# Altium schematic sheet Gagabiro_supply_maida.SchDoc: Gagabiro Power Supply Main
size 292 x 193 mm; ApprovedBy: None; CheckedBy: None; Author: João Victor Colombari Carlet; CompanyName: SEL; DrawnBy: João Victor Colombari Carlet; Engineer: João Victor Colombari Carlet; Organization: SEL; Address1: EESC - USP; Address2: 400, Trabalhador São-Carlense Av.; Address3: 13566-590, São Carlos; Address4: São Paulo, Brazil; DocumentNumber: Doc Num; Revision: 0; SheetNumber: 2; SheetTotal: 4
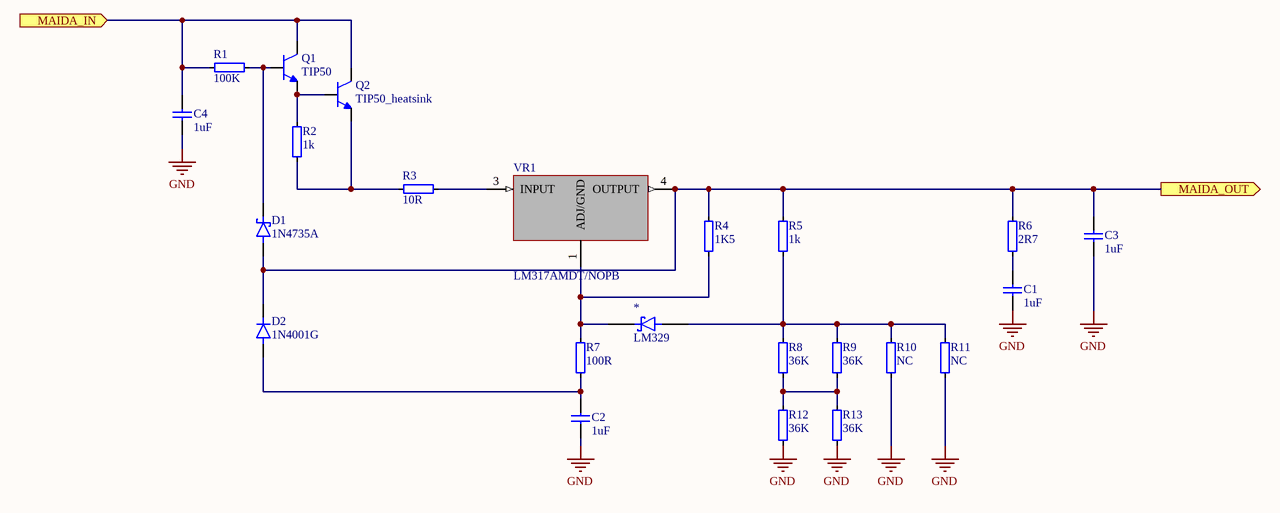
[diagram p0: Gagabiro_supply_maida.SchDoc]

## Parts
*  LM329  [TO92127P495H495-3]
C1  1uF  [CAP_panassonic_1u_450V]
C2  1uF  [CAP_panassonic_1u_450V]
C3  1uF  [CAP_panassonic_1u_450V]
C4  1uF  [CAP_panassonic_1u_450V]
D1  1N4735A  [DIOAD1036W78L463D272]
D2  1N4001G  [DIOAD1036W78L470D235]
Q1  TIP50  [TO254P1009X445X1985-3]
Q2  TIP50_heatsink  [TO254P1009X445X1985-3_heatsink]
R1  100K  [RES_2W_vertical]
R2  1k  [RES_2W_vertical]
R3  10R  [RES_2W_vertical]
R4  1K5  [RES_2W_vertical]
R5  1k  [RES_2W_vertical]
R6  2R7  [RES_2W_vertical]
R7  100R  [RES_2W_vertical]
R8  36K  [RES_2W_vertical]
R9  36K  [RES_2W_vertical]
R10  NC  [RES_2W_vertical]
R11  NC  [RES_2W_vertical]
R12  36K  [RES_2W_vertical]
R13  36K  [RES_2W_vertical]
VR1  LM317AMDT/NOPB  [TO228P991X255-3N]

## Ports
MAIDA_IN (in, see Gagabiro_supply_cover[4C]), MAIDA_OUT (out, see Gagabiro_supply_cover[4C])

## Nets
GND: C1.1 C2.1 C3.1 C4.1 R10.1 R11.1 R12.1 R13.1
MAIDA_IN: C4.2 Q1.2(C) Q2.2(C) R1.1 ; port MAIDA_IN
MAIDA_OUT: C3.2 D1.2(A) D2.C(K) R4.2 R5.2 R6.2 VR1.4(OUTPUT) ; port MAIDA_OUT
Net*_2: *.2 R4.1 R7.2 VR1.1(ADJ/GND)
Net*_3: *.3 R5.1 R8.2 R9.2 R10.2 R11.2
NetC1_2: C1.2 R6.1
NetC2_2: C2.2 D2.A R7.1
NetD1_1: D1.1(K) Q1.1(B) R1.2
NetQ1_3: Q1.3(E) Q2.1(B) R2.2
NetQ2_3: Q2.3(E) R2.1 R3.2
NetR3_1: R3.1 VR1.3(INPUT)
NetR8_1: R8.1 R9.1 R12.2 R13.2

## Notes on the sheet
- Title:
- Drawn By:
- Size:
- Date:
- File:
- A3
- Number:
- Time:
- Revision:
- Sheet
- of
- Website:

## Library data of the parts
C1-C4 = CAP_POLY_1u: Capacitor, Silver Mica; Part Number: CMICA_47PF; Value: 1uF
D1 = 1N4735A: Zener Diode 6.2V 1W Â±5% Through Hole DO-204AL (DO-41); MF: ON Semiconductor; SnapEDA_Link: https://www.snapeda.com/parts/1N4735A/Onsemi/view-part/?ref=snap; Package: DO-41 ON Semiconductor; Value: *; MP: 1N4735A; Check_prices: https://www.snapeda.com/parts/1N4735A/Onsemi/view-part/?ref=eda
D2 = 1N4001G: 1A, 50V, Standard Recovery Rectifier; MF: Taiwan Semiconductor; Package: DO-41-2 Taiwan Semiconductor; Check_prices: https://www.snapeda.com/parts/1N4001G/Taiwan+Semiconductor/view-part/?ref=eda; Value: *; Price: None; MP: 1N4001G; Purchase-URL: https://pricing.snapeda.com/search/part/1N4001G/?ref=eda; SnapEDA_Link: https://www.snapeda.com/parts/1N4001G/Taiwan+Semiconductor/view-part/?ref=snap; Availability: In Stock
Q1 = TIP50: Bipolar (BJT) Transistor NPN 400 V 1 A 10MHz 2 W Through Hole TO-220-3; MF: ON Semiconductor; Price: None; SnapEDA_Link: https://www.snapeda.com/parts/TIP50/Onsemi/view-part/?ref=snap; Availability: In Stock; Value: *; MP: TIP50; Purchase-URL: https://pricing.snapeda.com/search/part/TIP50/?ref=eda; Package: TO-220-3 onsemi; Check_prices: https://www.snapeda.com/parts/TIP50/Onsemi/view-part/?ref=eda
Q2 = TIP50_heatsink: Bipolar (BJT) Transistor NPN 400 V 1 A 10MHz 2 W Through Hole TO-220-3; MF: ON Semiconductor; MP: TIP50; Price: None; SnapEDA_Link: https://www.snapeda.com/parts/TIP50/Onsemi/view-part/?ref=snap; Availability: In Stock; Value: *; Purchase-URL: https://pricing.snapeda.com/search/part/TIP50/?ref=eda; Package: TO-220-3 onsemi; Check_prices: https://www.snapeda.com/parts/TIP50/Onsemi/view-part/?ref=eda
R1 = R_2W_vertical_100K: Resistor, 2W; Part Number: R2W; ComponentLink1URL: N.A.; ComponentLink1Description: Datasheet; ComponentLink2URL: N.A.; ComponentLink2Description: Supplier link; Author: colombari; Value: 100K
R2 R5 = R_2W_vertical_1k: Resistor, 2W; Part Number: R2W; ComponentLink1URL: N.A.; ComponentLink1Description: Datasheet; ComponentLink2URL: N.A.; ComponentLink2Description: Supplier link; Author: colombari; Value: 1k
R3 = R_2W_vertical_10R: Resistor, 2W; Part Number: R2W; ComponentLink1URL: N.A.; ComponentLink1Description: Datasheet; ComponentLink2URL: N.A.; ComponentLink2Description: Supplier link; Author: colombari; Value: 10R
R4 = R_2W_vertical_1K5: Resistor, 2W; Part Number: R2W; ComponentLink1URL: N.A.; ComponentLink1Description: Datasheet; ComponentLink2URL: N.A.; ComponentLink2Description: Supplier link; Author: colombari; Value: 1K5
R6 = R_2W_vertical_2R7: Resistor, 2W; Part Number: R2W; ComponentLink1URL: N.A.; ComponentLink1Description: Datasheet; ComponentLink2URL: N.A.; ComponentLink2Description: Supplier link; Author: colombari; Value: 2R7
R7 = R_2W_vertical_100R: Resistor, 2W; Part Number: R2W; ComponentLink1URL: N.A.; ComponentLink1Description: Datasheet; ComponentLink2URL: N.A.; ComponentLink2Description: Supplier link; Author: colombari; Value: 100R
R8 R9 R12 R13 = R_2W_vertical_36K: Resistor, 2W; Part Number: R2W; ComponentLink1URL: N.A.; ComponentLink1Description: Datasheet; ComponentLink2URL: N.A.; ComponentLink2Description: Supplier link; Author: colombari; Value: 36K
R10 R11 = R_2W_vertical_NC: Resistor, 2W; Part Number: R2W; ComponentLink1URL: N.A.; ComponentLink1Description: Datasheet; ComponentLink2URL: N.A.; ComponentLink2Description: Supplier link; Author: colombari; Value: NC
VR1 = LM317AMDT/NOPB: Package: None; MP: LM317AMDT/NOPB; Price: None; Availability: Unavailable; Value: *